# EAGLE design M623E (EAGLE 6.6.0)
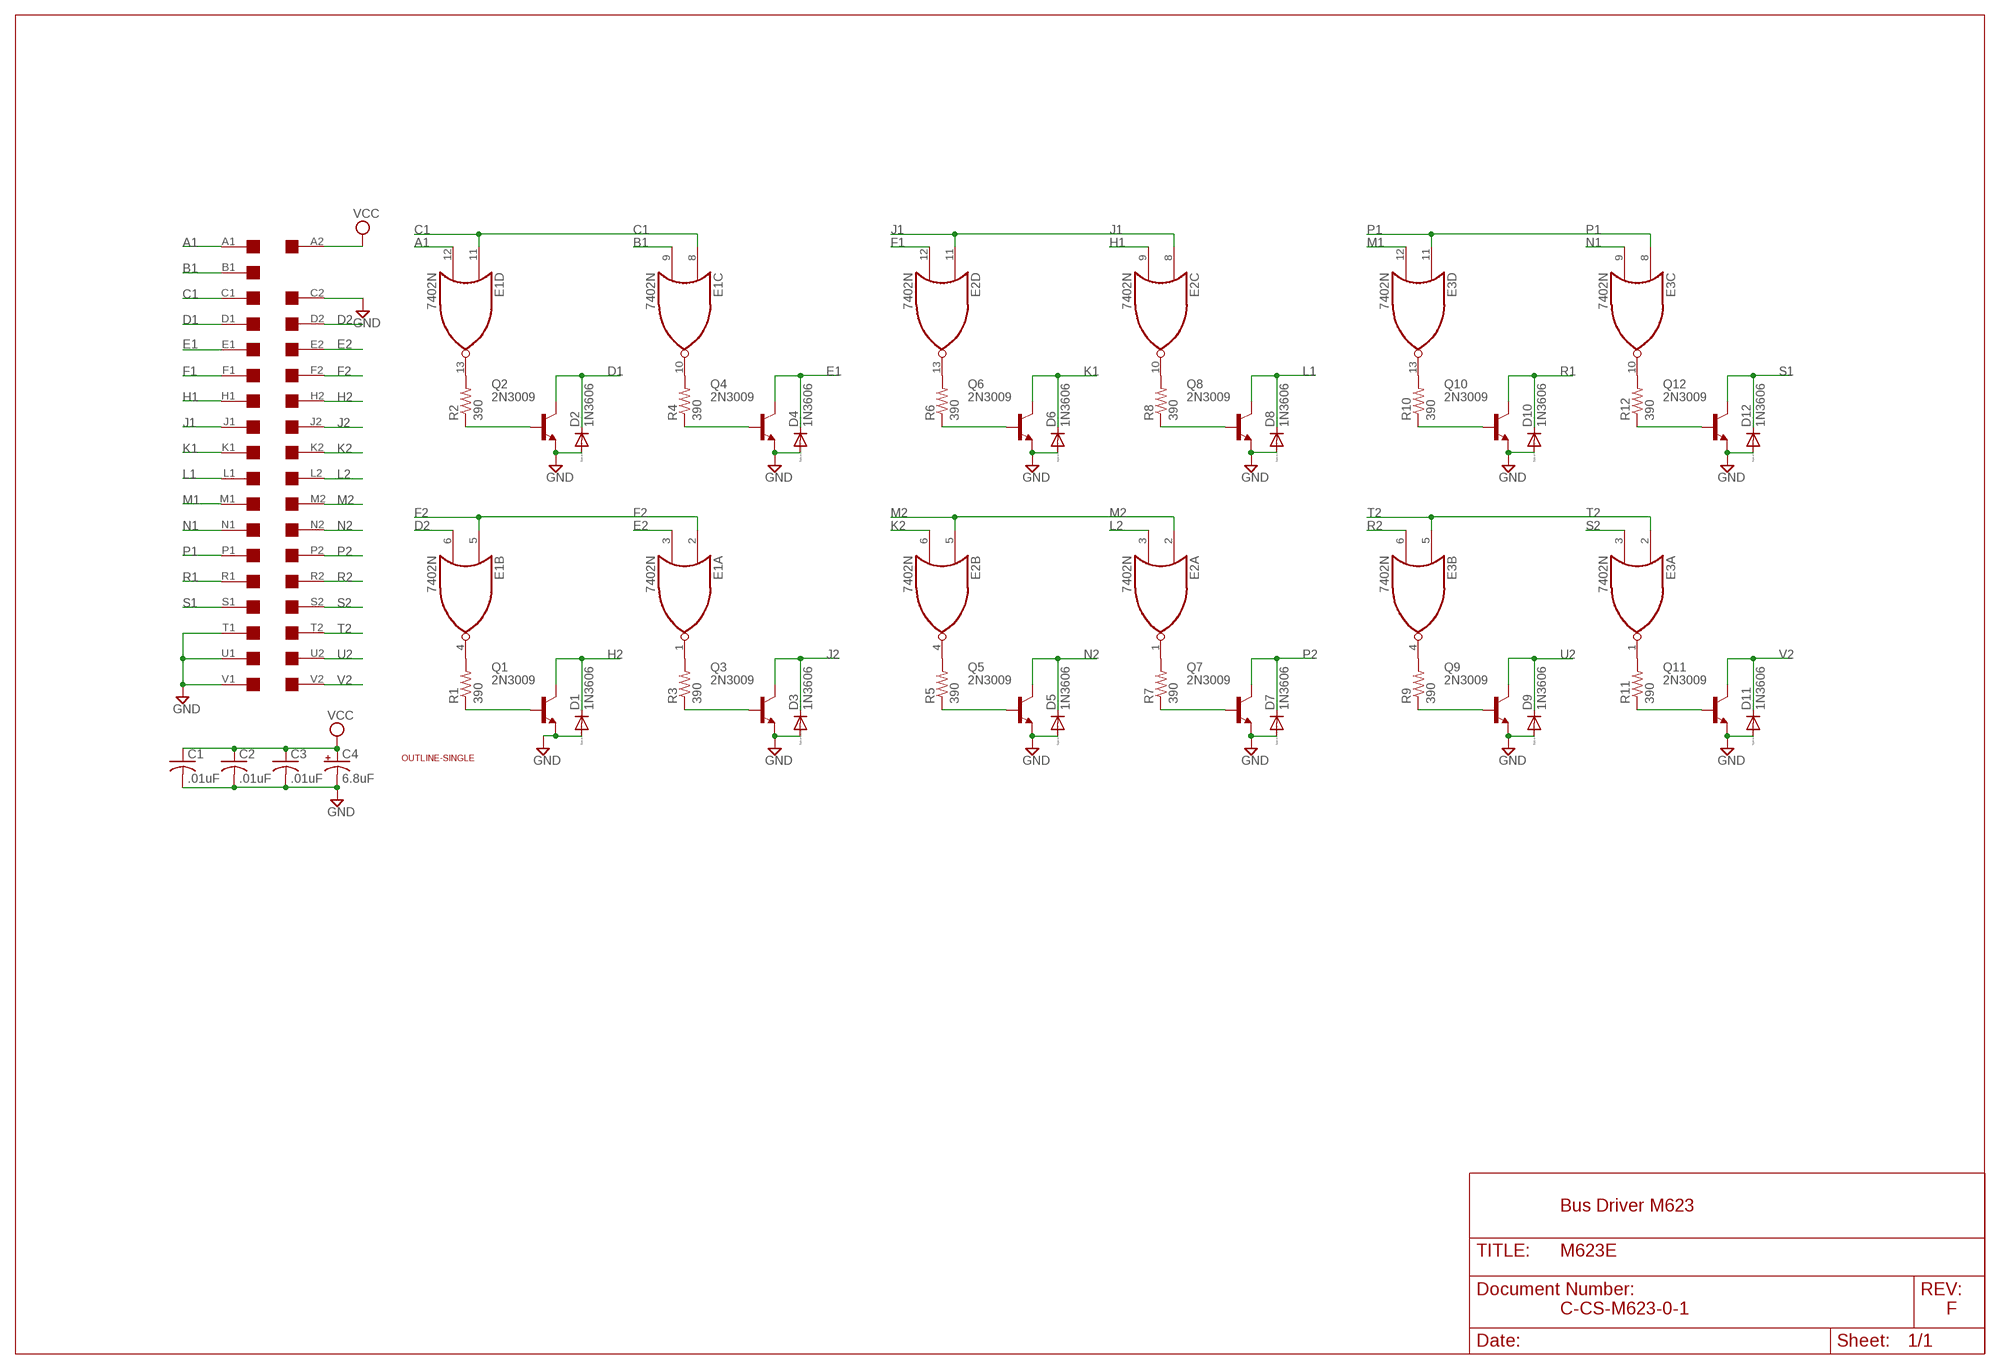
[diagram p0: schematic, sheet 1]

## Parts
C1  .01uF  C-US050-025X075  [C050-025X075]
C2  .01uF  C-US050-025X075  [C050-025X075]
C3  .01uF  C-US050-025X075  [C050-025X075]
C4  6.8uF  CPOL-USE20-8AXIAL  [E12-8]
D1  1N3606  1N4148DO35-10  [DO35-10]
D2  1N3606  1N4148DO35-10  [DO35-10]
D3  1N3606  1N4148DO35-10  [DO35-10]
D4  1N3606  1N4148DO35-10  [DO35-10]
D5  1N3606  1N4148DO35-10  [DO35-10]
D6  1N3606  1N4148DO35-10  [DO35-10]
D7  1N3606  1N4148DO35-10  [DO35-10]
D8  1N3606  1N4148DO35-10  [DO35-10]
D9  1N3606  1N4148DO35-10  [DO35-10]
D10  1N3606  1N4148DO35-10  [DO35-10]
D11  1N3606  1N4148DO35-10  [DO35-10]
D12  1N3606  1N4148DO35-10  [DO35-10]
E1  7402N  [DIL14]
E2  7402N  [DIL14]
E3  7402N  [DIL14]
Q1  2N3009  2N1613-NPN-TO39-EBC  [TO39]
Q2  2N3009  2N1613-NPN-TO39-EBC  [TO39]
Q3  2N3009  2N1613-NPN-TO39-EBC  [TO39]
Q4  2N3009  2N1613-NPN-TO39-EBC  [TO39]
Q5  2N3009  2N1613-NPN-TO39-EBC  [TO39]
Q6  2N3009  2N1613-NPN-TO39-EBC  [TO39]
Q7  2N3009  2N1613-NPN-TO39-EBC  [TO39]
Q8  2N3009  2N1613-NPN-TO39-EBC  [TO39]
Q9  2N3009  2N1613-NPN-TO39-EBC  [TO39]
Q10  2N3009  2N1613-NPN-TO39-EBC  [TO39]
Q11  2N3009  2N1613-NPN-TO39-EBC  [TO39]
Q12  2N3009  2N1613-NPN-TO39-EBC  [TO39]
R1  390  R-US_0207/10  [0207/10]
R2  390  R-US_0207/10  [0207/10]
R3  390  R-US_0207/10  [0207/10]
R4  390  R-US_0207/10  [0207/10]
R5  390  R-US_0207/10  [0207/10]
R6  390  R-US_0207/10  [0207/10]
R7  390  R-US_0207/10  [0207/10]
R8  390  R-US_0207/10  [0207/10]
R9  390  R-US_0207/10  [0207/10]
R10  390  R-US_0207/10  [0207/10]
R11  390  R-US_0207/10  [0207/10]
R12  390  R-US_0207/10  [0207/10]
U$1  OUTLINE-SINGLE  [SINGLE]
U$4  SINGLE  [EDGE-CON2]

## Nets
A1: E1.12(D:I1) U$4.A1
B1: E1.9(C:I1) U$4.B1
C1: E1.8(C:I0) E1.11(D:I0) U$4.C1
D1: D2.C Q2.3(C) U$4.D1
D2: E1.6(B:I1) U$4.D2
E1: D4.C Q4.3(C) U$4.E1
E2: E1.3(A:I1) U$4.E2
F1: E2.12(D:I1) U$4.F1
F2: E1.2(A:I0) E1.5(B:I0) U$4.F2
GND [Supply]: C1.2 C2.2 C3.2 C4.- D1.A D2.A D3.A D4.A D5.A D6.A D7.A D8.A D9.A D10.A D11.A D12.A Q1.1(E) Q2.1(E) Q3.1(E) Q4.1(E) Q5.1(E) Q6.1(E) Q7.1(E) Q8.1(E) Q9.1(E) Q10.1(E) Q11.1(E) Q12.1(E) U$4.C2 U$4.T1 U$4.U1 U$4.V1
H1: E2.9(C:I1) U$4.H1
H2: D1.C Q1.3(C) U$4.H2
J1: E2.8(C:I0) E2.11(D:I0) U$4.J1
J2: D3.C Q3.3(C) U$4.J2
K1: D6.C Q6.3(C) U$4.K1
K2: E2.6(B:I1) U$4.K2
L1: D8.C Q8.3(C) U$4.L1
L2: E2.3(A:I1) U$4.L2
M1: E3.12(D:I1) U$4.M1
M2: E2.2(A:I0) E2.5(B:I0) U$4.M2
N1: E3.9(C:I1) U$4.N1
N2: D5.C Q5.3(C) U$4.N2
N$1: E1.13(D:O) R2.2
N$2: Q2.2(B) R2.1
N$3: E1.4(B:O) R1.2
N$4: Q1.2(B) R1.1
N$12: E1.10(C:O) R4.2
N$13: E1.1(A:O) R3.2
N$14: E2.4(B:O) R5.2
N$15: E2.13(D:O) R6.2
N$16: E2.1(A:O) R7.2
N$17: E2.10(C:O) R8.2
N$18: E3.4(B:O) R9.2
N$19: E3.13(D:O) R10.2
N$20: E3.1(A:O) R11.2
N$21: E3.10(C:O) R12.2
N$22: Q12.2(B) R12.1
N$24: Q4.2(B) R4.1
N$25: Q6.2(B) R6.1
N$26: Q8.2(B) R8.1
N$27: Q10.2(B) R10.1
N$28: Q3.2(B) R3.1
N$29: Q5.2(B) R5.1
N$30: Q7.2(B) R7.1
N$31: Q9.2(B) R9.1
N$32: Q11.2(B) R11.1
P1: E3.8(C:I0) E3.11(D:I0) U$4.P1
P2: D7.C Q7.3(C) U$4.P2
R1: D10.C Q10.3(C) U$4.R1
R2: E3.6(B:I1) U$4.R2
S1: D12.C Q12.3(C) U$4.S1
S2: E3.3(A:I1) U$4.S2
T2: E3.2(A:I0) E3.5(B:I0) U$4.T2
U2: D9.C Q9.3(C) U$4.U2
V2: D11.C Q11.3(C) U$4.V2
VCC [Supply]: C1.1 C2.1 C3.1 C4.+ U$4.A2
Unconnected: U$4.B2

## Notes on the sheet
- Bus Driver M623
- C-CS-M623-0-1 | F

## Power pins joined to a net without a drawn wire
GND: E1.7(P:GND) E2.7(P:GND) E3.7(P:GND)
VCC: E1.14(P:VCC) E2.14(P:VCC) E3.14(P:VCC)

## Library data of the parts
C1-C3 = rcl:C-US: CAPACITOR, American symbol
C4 = dec-con:CPOL-USE20-8AXIAL: A 0.8 inch electrolytic.
D1-D12 = diode:1N4148: DIODE high speed (Philips)
E1-E3 = 74xx-us:74*02: Quad 2-input NOR gate
Q1-Q12 = transistor:*-NPN-: NPN Transistror BF959 corrected 2008.03.06
R1-R12 = rcl:R-US_: RESISTOR, American symbol
U$1 = dec-con:OUTLINE-*: Board outlines for DEC boards.
U$4 = dec-con:SINGLE: Single-Height DEC board

## Net classes
1 Supply: width 0.813 mm

## Board
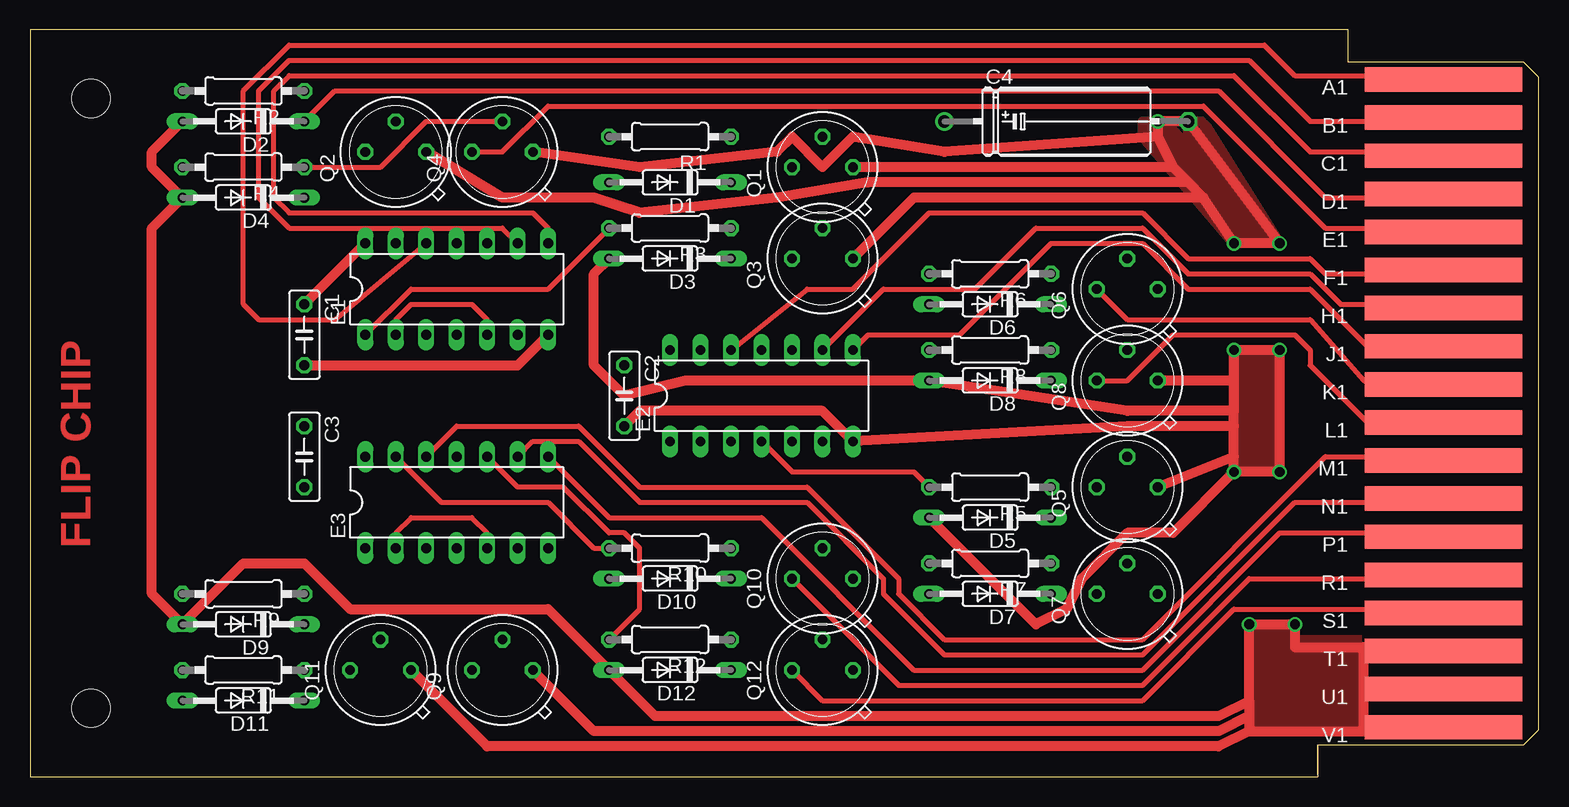
[diagram p1: board, top side]
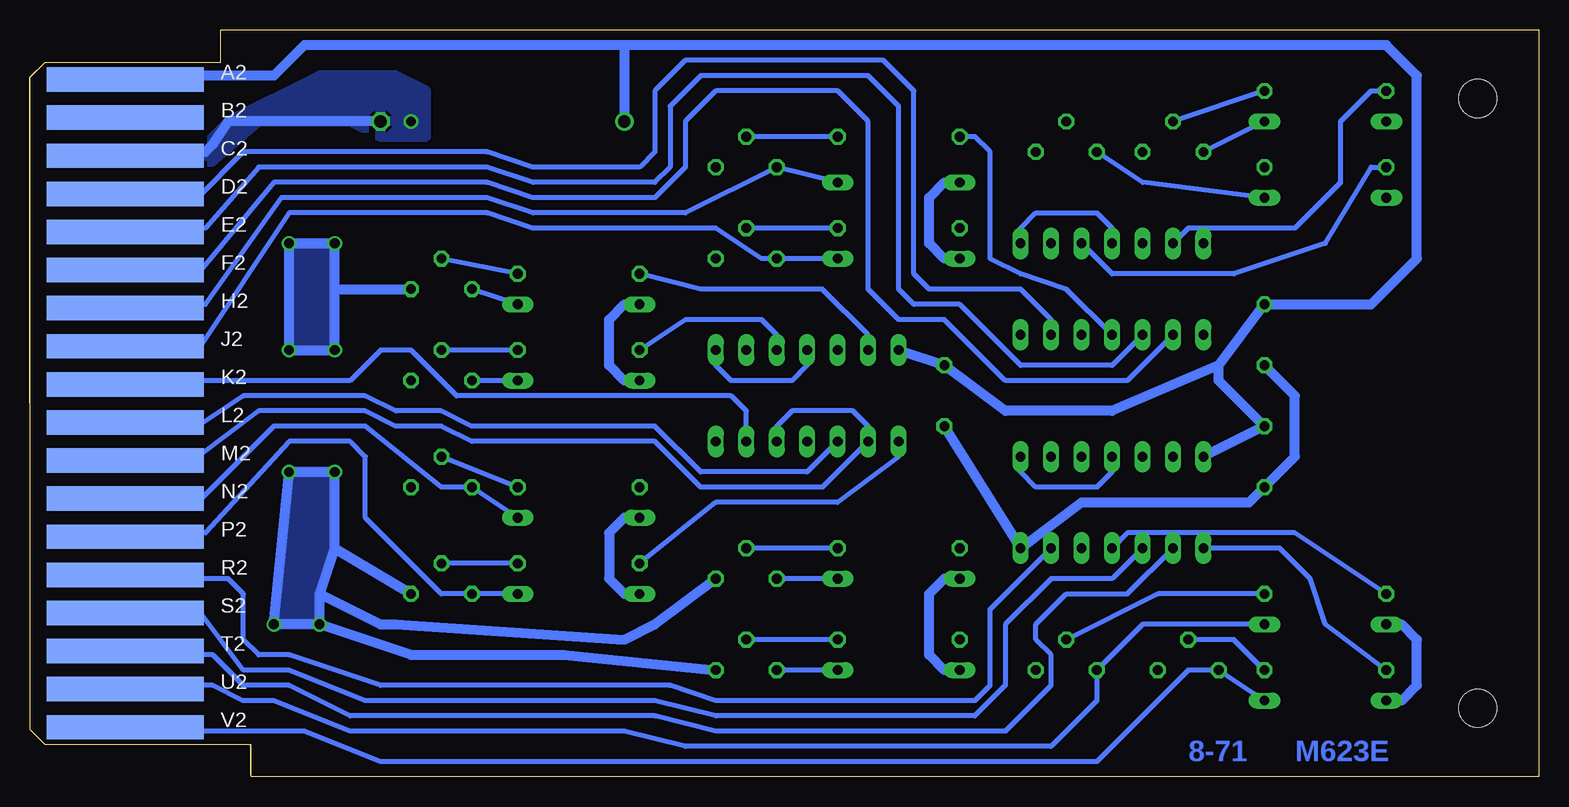
[diagram p2: board, bottom side, seen from below]

Size 125.73 x 62.23 mm. Coordinates in mm from the lower left corner, seen from the top.
Copper layers (1+16): Top 0.035mm / dielectric 1.5mm / Bottom 0.035mm
Design rules "16mils": minimum track width 16mil, minimum drill 32mil, track to track 15mil, track to pad 10mil, pad to pad 10mil, via to via 10mil, smd to smd 10mil, copper to edge 13mil, drill to drill 10mil, minimum pad ring 10mil, minimum via ring 8mil, stop-mask expansion 0mil, vias tented up to drill 0mil, thermal gap 10mil

### Footprints (pad centres in the part's own frame; a part is rotated, then mirrored left to right if it is on the bottom)
C050-025X075 = drill 0.813 octagon: 1 -2.54,0; 2 2.54,0
E12-8 = drill 1.016: + -10.16,0 | drill 1.016 octagon: - 10.16,0
DO35-10 = drill 0.813 long: A 5.08,0; C -5.08,0
DIL14 = drill 0.813 long: 1 -7.62,-3.81; 2 -5.08,-3.81; 3 -2.54,-3.81; 4 0,-3.81; 5 2.54,-3.81; 6 5.08,-3.81; 7 7.62,-3.81; 8 7.62,3.81; 9 5.08,3.81; 10 2.54,3.81; 11 0,3.81; 12 -2.54,3.81; 13 -5.08,3.81; 14 -7.62,3.81
TO39 = drill 0.813 octagon: 1 0,-2.54; 2 2.54,0; 3 0,2.54
0207/10 = drill 0.813 octagon: 1 -5.08,0; 2 5.08,0
SINGLE = hole 3.175: 120.65,56.515; 120.65,5.715
EDGE-CON2 = smd 13.106 x 2.032: A1 7.938,4.128; B1 7.938,7.303; C1 7.938,10.477; D1 7.938,13.652; E1 7.938,16.828; F1 7.938,20.003; H1 7.938,23.177; J1 7.938,26.352; K1 7.938,29.527; L1 7.938,32.703; M1 7.938,35.877; N1 7.938,39.053; P1 7.938,42.227; R1 7.938,45.403; S1 7.938,48.578; T1 7.938,51.752; U1 7.938,54.928; V1 7.938,58.102 | smd 13.106 x 2.032 bottom: A2 7.938,4.128; B2 7.938,7.303; C2 7.938,10.477; D2 7.938,13.652; E2 7.938,16.828; F2 7.938,20.003; H2 7.938,23.177; J2 7.938,26.352; K2 7.938,29.527; L2 7.938,32.703; M2 7.938,35.877; N2 7.938,39.053; P2 7.938,42.227; R2 7.938,45.403; S2 7.938,48.578; T2 7.938,51.752; U2 7.938,54.928; V2 7.938,58.102

### Placement (x,y rotation side)
C1  22.86,36.83 270 top
C2  49.53,31.75 270 top
C3  22.86,26.67 270 top
C4  86.36,54.61 0 top
D1  53.34,49.53 180 top
D2  17.78,54.61 180 top
D3  53.34,43.18 180 top
D4  17.78,48.26 180 top
D5  80.01,21.59 180 top
D6  80.01,39.37 180 top
D7  80.01,15.24 180 top
D8  80.01,33.02 180 top
D9  17.78,12.7 180 top
D10  53.34,16.51 180 top
D11  17.78,6.35 180 top
D12  53.34,8.89 180 top
E1  35.56,40.64 0 top
E2  60.96,31.75 0 top
E3  35.56,22.86 0 top
Q1  66.04,50.8 90 top
Q2  30.48,52.07 90 top
Q3  66.04,43.18 90 top
Q4  39.37,52.07 90 top
Q5  91.44,24.13 90 top
Q6  91.44,40.64 90 top
Q7  91.44,15.24 90 top
Q8  91.44,33.02 90 top
Q9  39.37,8.89 90 top
Q10  66.04,16.51 90 top
Q11  29.21,8.89 90 top
Q12  66.04,8.89 90 top
R1  53.34,53.34 180 top
R2  17.78,57.15 180 top
R3  53.34,45.72 180 top
R4  17.78,50.8 180 top
R5  80.01,24.13 180 top
R6  80.01,41.91 180 top
R7  80.01,17.78 180 top
R8  80.01,35.56 180 top
R9  17.78,15.24 180 top
R10  53.34,19.05 180 top
R11  17.78,8.89 180 top
R12  53.34,11.43 180 top
U$1  125.73,62.23 180 top
U$2  [FLIPCHIP]  0,0 0 top
U$4  125.73,62.23 180 top

### Tracks (layer width: path | path; a pad name or v marks a point on that pad's centre or on a via)
A1
  Top 0.406: U$4.A1 116.84,58.42 105.41,58.42 102.87,60.96 21.59,60.96 17.78,57.15 17.78,39.37 19.05,38.1 25.4,38.1 E1.12
B1
  Top 0.406: U$4.B1 116.84,54.61 106.68,54.61 101.6,59.69 21.59,59.69 19.05,57.15 19.05,48.26 21.59,45.72 39.37,45.72 E1.9
C1
  Top 0.406: U$4.C1 116.84,52.07 106.68,52.07 100.33,58.42 21.59,58.42 20.32,57.15 20.32,48.26 21.59,46.99 41.91,46.99 43.18,45.72 E1.8
  Bottom 0.406: E1.11 35.56,45.72 36.83,46.99 41.91,46.99 43.18,45.72 E1.8
D1
  Top 0.406: U$4.D1 116.84,48.26 107.95,48.26 99.06,57.15 25.4,57.15 D2.C
  Bottom 0.406: D2.C Q2.3
D2
  Bottom 0.406: U$4.D2 116.84,48.26 111.76,48.26 107.95,52.07 87.63,52.07 83.82,50.8 74.93,50.8 73.66,52.07 73.66,57.15 71.12,59.69 54.61,59.69 52.07,57.15 52.07,41.91 50.8,40.64 43.18,40.64 40.64,38.1 E1.6
E1
  Top 0.406: U$4.E1 116.84,45.72 107.95,45.72 97.79,55.88 43.18,55.88 39.37,52.07 Q4.3
  Bottom 0.406: D4.C 33.02,49.53 Q4.3
E2
  Bottom 0.406: E1.3 35.56,34.29 43.18,34.29 48.26,39.37 52.07,39.37 53.34,40.64 53.34,55.88 55.88,58.42 69.85,58.42 72.39,55.88 72.39,50.8 73.66,49.53 83.82,49.53 87.63,50.8 106.68,50.8 111.12,45.72 116.84,45.72 U$4.E2
F1
  Top 0.406: E2.12 64.77,40.64 68.58,40.64 74.93,46.99 92.71,46.99 96.52,43.18 106.68,43.18 107.95,41.91 116.84,41.91 U$4.F1
F2
  Top 0.406: E1.5 38.1,38.1 36.83,39.37 31.75,39.37 30.48,38.1 E1.2
  Bottom 0.406: E1.2 34.29,33.02 44.45,33.02 49.53,38.1 53.34,38.1 55.88,40.64 55.88,54.61 58.42,57.15 68.58,57.15 71.12,54.61 71.12,50.8 73.66,48.26 83.82,48.26 87.63,49.53 105.41,49.53 111.76,41.91 116.84,41.91 U$4.F2
GND  (via drill 0.81)
  Top 0.813: 97.79,48.26 v100.33,44.45 v104.14,44.45 C4.- v93.98,54.61 93.98,53.34 | 97.79,48.26 96.52,49.53 | 96.52,49.53 95.25,50.8 | 93.98,53.34 95.25,50.8 | v100.33,25.4 100.33,26.67 | 100.33,33.02 v100.33,35.56 v104.14,35.56 v104.14,25.4 v100.33,25.4 | 100.33,33.02 100.33,30.48 | 100.33,29.21 100.33,30.48 | 100.33,26.67 100.33,29.21 | U$4.V1 116.84,3.81 111.12,3.81 | 101.6,3.81 111.12,3.81 | 101.6,6.35 v101.6,12.7 v105.41,12.7 105.41,10.79 111.12,10.79 | 101.6,6.35 101.6,5.08 | 101.6,5.08 101.6,3.81 | U$4.U1 116.84,7.62 111.12,7.62 | U$4.T1 116.84,10.16 111.12,10.79 | 111.12,7.62 111.12,10.79 | 111.12,3.81 111.12,7.62 | D2.A 10.16,52.07 10.16,50.8 D4.A 10.16,45.72 10.16,15.24 D9.A 17.78,17.78 22.86,17.78 26.67,13.97 43.18,13.97 D12.A 52.07,5.08 99.06,5.08 101.6,6.35 | E1.7 40.64,34.29 C1.2 | D3.A 46.99,41.91 46.99,34.29 49.53,31.75 54.61,33.02 D8.A 91.44,30.48 100.33,30.48 | Q4.1 50.8,50.8 62.23,52.07 63.5,53.34 66.04,50.8 68.58,53.34 76.2,52.07 93.98,53.34 | Q2.1 39.37,48.26 46.99,48.26 50.8,46.99 62.23,48.26 69.85,49.53 96.52,49.53 | 95.25,50.8 Q1.1 | Q3.1 73.66,48.26 97.79,48.26 | 100.33,26.67 Q5.1 | 100.33,29.21 91.44,29.21 E2.7 66.04,30.48 50.8,30.48 C2.2 | D5.A 83.82,12.7 86.36,13.97 87.63,16.51 91.44,20.32 95.25,20.32 v100.33,25.4 | 100.33,33.02 Q8.1 | Q9.1 46.99,3.81 99.06,3.81 101.6,5.08 | Q11.1 38.1,2.54 99.06,2.54 101.6,3.81
  Bottom 0.813: C1.2 20.32,31.75 20.32,26.67 C3.2 24.13,22.86 38.1,22.86 E3.7 C2.2 | U$4.C2 116.84,52.07 111.12,52.07 110.49,52.7 109.22,54.61 C4.- | 100.33,40.64 Q6.1 | 100.33,40.64 v100.33,44.45 v104.14,44.45 v104.14,35.56 v100.33,35.56 100.33,40.64 | 100.33,19.05 Q7.1 | 100.33,19.05 v100.33,25.4 v104.14,25.4 v105.41,12.7 v101.6,12.7 | Q10.1 73.66,12.7 76.2,11.43 95.25,12.7 96.52,12.7 101.6,15.24 | 101.6,15.24 100.33,19.05 | Q12.1 81.28,10.16 93.98,10.16 v101.6,12.7 | v101.6,12.7 101.6,15.24 | D6.A 76.2,39.37 77.47,38.1 77.47,34.29 76.2,33.02 D8.A | D7.A 76.2,15.24 77.47,16.51 77.47,20.32 76.2,21.59 D5.A | D12.A 49.53,8.89 50.8,10.16 50.8,15.24 49.53,16.51 D10.A | D11.A 11.43,6.35 10.16,7.62 10.16,11.43 11.43,12.7 D9.A | D1.A 49.53,49.53 50.8,48.26 50.8,44.45 49.53,43.18 D3.A
  pour Bottom: 111.12,52.7 111.12,50.8 106.68,54.61 99.06,54.61 96.52,53.34 92.71,53.34 92.71,57.15 95.25,58.42 101.6,58.42 109.22,54.61
  pour Top: 111.76,3.81 101.6,3.81 101.6,12.7 105.41,12.7 105.41,11.43 111.76,11.43
  pour Top: 100.33,25.4 100.33,35.56 104.14,35.56 104.14,25.4
  pour Top: 92.71,54.61 97.79,54.61 104.14,44.45 100.33,44.45 92.71,53.34
  pour Bottom: 100.33,44.45 104.14,44.45 104.14,35.56 100.33,35.56
  pour Bottom: 101.6,12.7 101.6,15.24 100.33,19.05 100.33,25.4 104.14,25.4 105.41,12.7
H1
  Top 0.406: E2.9 71.12,40.64 78.74,40.64 83.82,45.72 92.71,45.72 96.52,41.91 106.68,41.91 109.22,39.37 116.84,39.37 U$4.H1
H2
  Bottom 0.406: U$4.H2 116.84,39.37 111.12,39.37 104.78,48.26 87.63,48.26 83.82,46.99 71.12,46.99 Q1.3 D1.C
J1
  Top 0.406: E2.8 69.85,36.83 77.47,36.83 85.09,44.45 92.71,44.45 96.52,40.64 106.68,40.64 111.76,35.56 116.84,35.56 U$4.J1
  Bottom 0.406: E2.11 60.96,34.29 62.23,33.02 67.31,33.02 68.58,34.29 E2.8
J2
  Bottom 0.406: D3.C Q3.3 64.77,43.18 68.58,45.72 83.82,45.72 87.63,46.99 104.14,46.99 111.76,35.56 116.84,35.56 U$4.J2
K1
  Top 0.406: Q6.3 91.44,38.1 106.68,38.1 111.12,33.02 116.84,33.02 U$4.K1
  Bottom 0.406: D6.C Q6.3
K2
  Bottom 0.406: E2.6 66.04,30.48 67.31,31.75 90.17,31.75 93.98,35.56 96.52,35.56 99.06,33.02 116.84,33.02 U$4.K2
L1
  Top 0.406: U$4.L1 116.84,29.21 111.76,29.21 106.68,34.29 106.68,35.56 105.41,36.83 95.25,36.83 91.44,33.02 Q8.3
  Bottom 0.406: D8.C Q8.3
L2
  Bottom 0.406: E2.3 60.96,25.4 69.85,25.4 73.66,29.21 88.9,29.21 91.44,30.48 95.25,30.48 97.79,31.75 107.95,31.75 111.76,29.21 116.84,29.21 U$4.L2
M1
  Top 0.406: U$4.M1 116.84,26.67 107.95,26.67 92.71,11.43 76.2,11.43 72.39,15.24 72.39,16.51 64.77,24.13 50.8,24.13 45.72,29.21 35.56,29.21 E3.12
M2
  Bottom 0.406: E2.5 63.5,29.21 62.23,30.48 57.15,30.48 55.88,29.21 E2.2 59.69,24.13 69.85,24.13 73.66,27.94 88.9,27.94 91.44,29.21 95.25,29.21 97.79,30.48 106.68,30.48 111.76,26.67 116.84,26.67 U$4.M2
N1
  Top 0.406: U$4.N1 116.84,22.86 105.41,22.86 92.71,10.16 76.2,10.16 71.12,15.24 71.12,16.51 64.77,22.86 50.8,22.86 45.72,27.94 41.91,27.94 E3.9
N2
  Bottom 0.406: D5.C Q5.3 91.44,24.13 97.79,29.21 105.41,29.21 111.76,22.86 116.84,22.86 U$4.N2
N$1
  Bottom 0.406: R2.2 13.97,57.15 16.51,54.61 16.51,49.53 20.32,45.72 29.21,45.72 E1.13
N$2
  Bottom 0.406: R2.1 Q2.2
N$3
  Bottom 0.406: E1.4 39.37,40.64 43.18,41.91 45.72,43.18 45.72,52.07 46.99,53.34 R1.2
N$4
  Bottom 0.406: R1.1 Q1.2
N$12
  Bottom 0.406: R4.2 13.97,50.8 17.78,44.45 25.4,41.91 35.56,41.91 E1.10
N$13
  Top 0.406: E1.1 31.75,40.64 43.18,40.64 R3.2
N$14
  Top 0.406: E2.4 63.5,25.4 73.66,25.4 R5.2
N$15
  Bottom 0.406: E2.13 55.88,36.83 59.69,40.64 69.85,40.64 R6.2
N$16
  Bottom 0.406: E2.1 53.34,26.67 58.42,22.86 68.58,22.86 R7.2
N$17
  Bottom 0.406: E2.10 63.5,36.83 64.77,38.1 71.12,38.1 R8.2
N$18
  Bottom 0.406: R9.2 20.32,20.32 34.29,20.32 E3.4
N$19
  Top 0.406: E3.13 34.29,22.86 43.18,22.86 46.99,19.05 R10.2
N$20
  Bottom 0.406: E3.1 21.59,19.05 19.05,16.51 17.78,12.7 R11.2
N$21
  Top 0.406: E3.10 40.64,24.13 44.45,24.13 48.26,20.32 49.53,20.32 50.8,19.05 50.8,13.97 R12.2
N$22
  Bottom 0.406: R12.1 Q12.2
N$24
  Top 0.406: R4.1 29.21,50.8 33.02,54.61 Q4.2
N$25
  Bottom 0.406: R6.1 Q6.2
N$26
  Bottom 0.406: R8.1 Q8.2
N$27
  Bottom 0.406: R10.1 Q10.2
N$28
  Bottom 0.406: R3.1 Q3.2
N$29
  Bottom 0.406: R5.1 Q5.2
N$30
  Bottom 0.406: R7.1 Q7.2
N$31
  Bottom 0.406: R9.1 31.75,15.24 Q9.2
N$32
  Bottom 0.406: R11.1 25.4,11.43 Q11.2
P1
  Top 0.406: U$4.P1 116.84,20.32 104.14,20.32 92.71,8.89 73.66,8.89 60.96,21.59 48.26,21.59 E3.8
  Bottom 0.406: E3.11 35.56,25.4 36.83,24.13 41.91,24.13 43.18,25.4 E3.8
P2
  Bottom 0.406: D7.C Q7.3 91.44,15.24 97.79,21.59 97.79,26.67 99.06,27.94 104.14,27.94 111.12,20.32 116.84,20.32 U$4.P2
R1
  Top 0.406: Q10.3 72.39,7.62 92.71,7.62 101.6,16.51 115.57,16.51 U$4.R1
  Bottom 0.406: D10.C Q10.3
R2
  Bottom 0.406: E3.6 45.72,13.97 45.72,7.62 46.99,6.35 68.58,6.35 72.39,7.62 96.52,7.62 104.14,10.16 106.68,10.16 107.95,11.43 107.95,15.24 109.22,16.51 116.84,16.51 U$4.R2
S1
  Top 0.406: U$4.S1 116.84,13.97 100.33,13.97 92.71,6.35 66.04,6.35 Q12.3
  Bottom 0.406: D12.C Q12.3
S2
  Bottom 0.406: E3.3 35.56,16.51 40.64,16.51 44.45,12.7 44.45,7.62 46.99,5.08 68.58,5.08 73.66,6.35 97.79,6.35 104.14,8.89 107.95,8.89 111.76,13.97 116.84,13.97 U$4.S2
T2
  Top 0.406: E3.5 38.1,20.32 36.83,21.59 31.75,21.59 30.48,20.32 E3.2
  Bottom 0.406: E3.2 34.29,15.24 39.37,15.24 41.91,12.7 41.91,11.43 40.64,10.16 40.64,7.62 44.45,3.81 68.58,3.81 73.66,5.08 99.06,5.08 104.14,7.62 107.95,7.62 110.49,10.16 116.84,10.16 U$4.T2
U2
  Bottom 0.406: D9.C 33.02,12.7 Q9.3 36.83,6.35 40.64,2.54 71.12,2.54 76.2,3.81 99.06,3.81 105.41,6.35 107.95,6.35 110.49,7.62 116.84,7.62 U$4.U2
V2
  Bottom 0.406: D11.C Q11.3 29.21,8.89 36.83,1.27 96.52,1.27 102.87,3.81 116.84,3.81 U$4.V2
VCC
  Top 0.813: C1.1 E1.14
  Bottom 0.813: U$4.A2 117.24,58.02 116.84,58.42 105.41,58.42 102.87,60.96 76.2,60.96 | 76.2,60.96 12.7,60.96 10.16,58.42 10.16,43.18 13.97,39.37 C1.1 26.67,34.29 | 76.2,60.96 C4.+ | 26.67,34.29 26.67,33.02 C3.1 E3.14 | 26.67,34.29 35.56,30.48 44.45,30.48 C2.1 E2.14

### Text on the board
Bottom: M623E | 8-71